# EasyEDA schematic ESP32-MoonLolita-PCB.json
TITLE: ESP32-MoonLolita; REV: 1.0; Date: 2022-09-04; Sheet: 1/1; Company: Bilibili 没人要的野指针
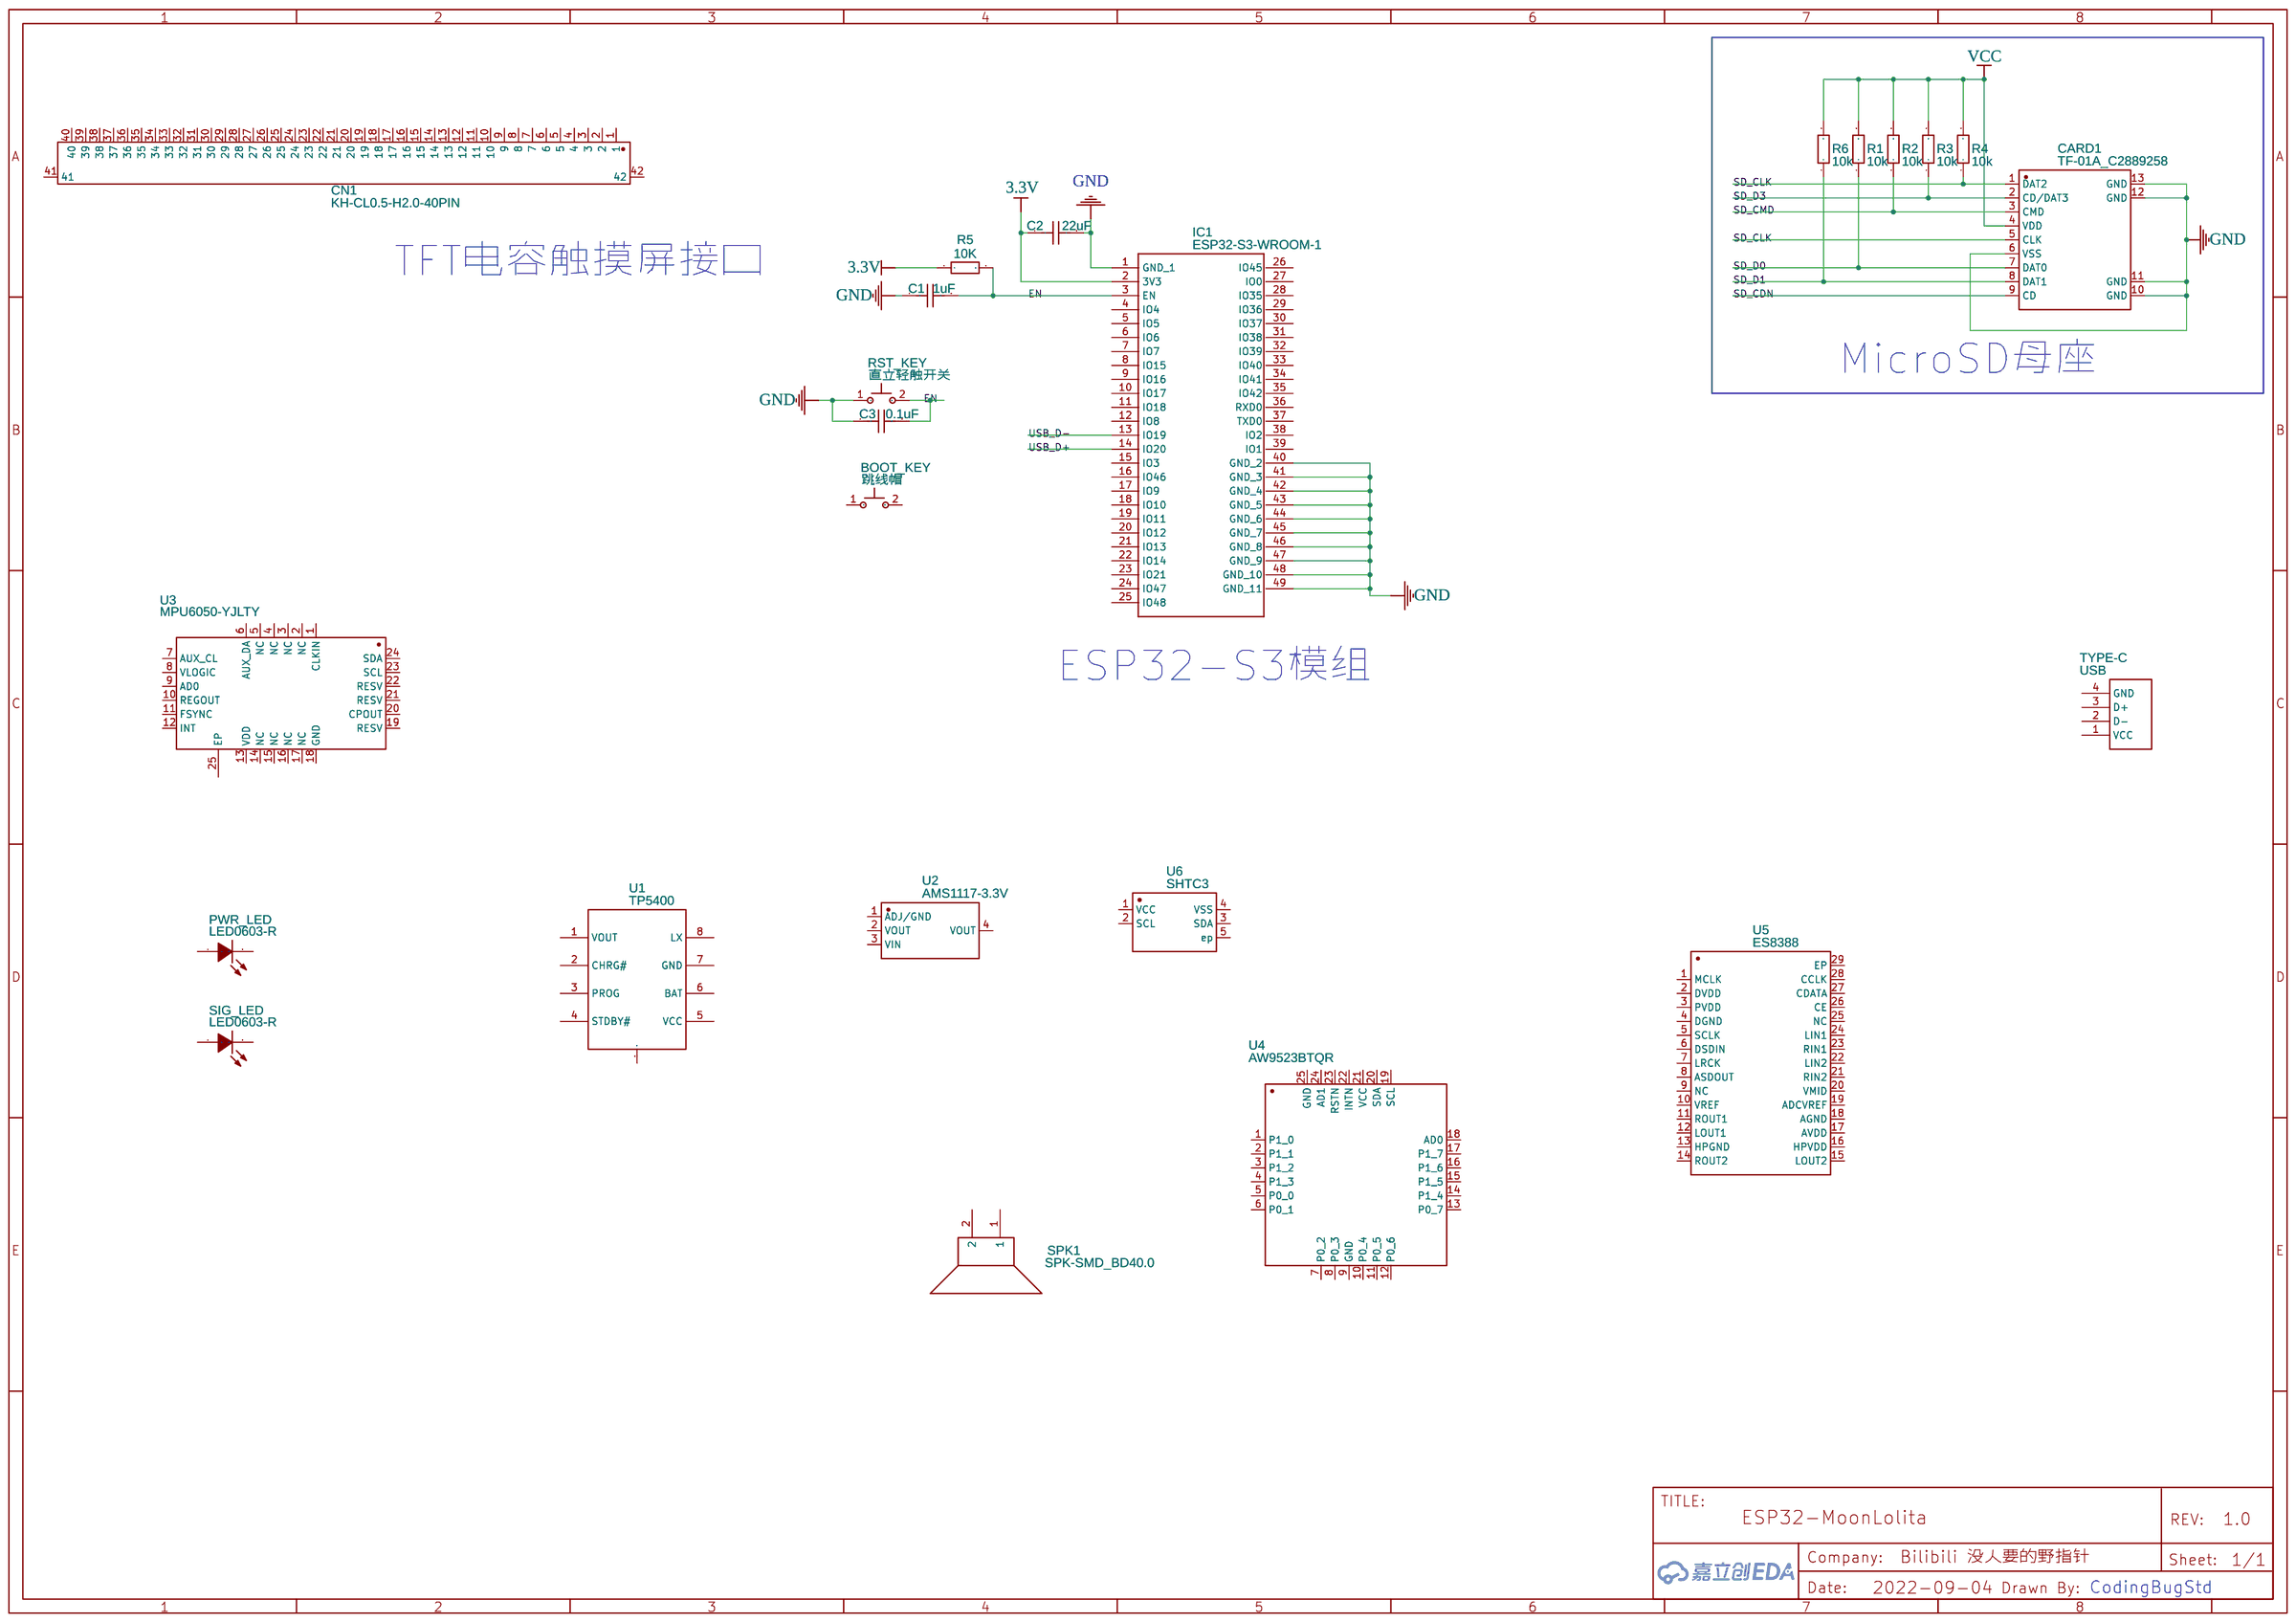
[diagram p0: schematic sheet]

## Parts
BOOT_KEY  跳线帽  [KEY-SMD_KSS-2G]
C1  1uF  [CAP-TH_L18.5-W11.5-P15.50-D1.2]
C2  22uF  [CAP-TH_L18.5-W11.5-P15.50-D1.2]
C3  0.1uF  [CAP-TH_L18.5-W11.5-P15.50-D1.2]
CARD1  TF-01A_C2889258  [TF-SMD_TF-02]
CN1  KH-CL0.5-H2.0-40PIN  [FPC-SMD_KH-CL0.5-H2.0-40PIN]
IC1  ESP32-S3-WROOM-1  [ESP32S3WROOM1]
PWR_LED  LED0603-R  [LED0603-R-RD]
R1  10k  [0603封装]
R2  10k  [0603封装]
R3  10k  [0603封装]
R4  10k  [0603封装]
R5  10K  [R1206]
R6  10k  [0603封装]
RST_KEY  直立轻触开关  [KEY-SMD_KSS-2G]
SIG_LED  LED0603-R  [LED0603-R-RD]
SPK1  SPK-SMD_BD40.0  [SPK-SMD_BD40.0]
TYPE-C  USB  [USB  USB-A-TH_USB-302-T]
U1  TP5400  [SOIC-8_L5.0-W4.0-P1.27-LS6.0-BL-EP2.0]
U2  AMS1117-3.3V  [SOT-223-4_L6.5-W3.5-P2.30-LS7.0-BR]
U3  MPU6050-YJLTY  [QFN-24_L4.0-W4.0-P0.50-BL-EP2.7]
U4  AW9523BTQR  [TQFN-24_L4.0-W4.0-P0.50-TL-EP]
U5  ES8388  [QFN-28_L4.0-W4.0-P0.45-BL-EP]
U6  SHTC3  [SENSORM-SMD_4P-L2.0-W2.0-P1.00]

## Library data of the parts
BOOT_KEY RST_KEY = KSS341GLFS: Supplier: LCSC; Supplier Part: C221798; Manufacturer: C&K; Contributor: LCSC; JLCPCB Part Class: Extended Part
C1-C3 = FGSM(161) 630VDC 224J 101F: Supplier: LCSC; Supplier Part: C185991; Manufacturer: SHINYEI; Contributor: LCSC; JLCPCB Part Class: Extended Part
CARD1 = TF-01A_C2889258: Supplier: LCSC; Supplier Part: C2889258; Manufacturer: Yuandi(台湾元迪); Manufacturer Part: TF-01A; Contributor: LCSC; JLCPCB Part Class: Extended Part
CN1 = KH-CL0.5-H2.0-40PIN: Supplier: LCSC; Supplier Part: C2797203; Manufacturer: kinghelm(金航标); JLCPCB Part Class: Extended Part; Contributor: LCSC
IC1 = ESP32-S3-WROOM-1: Contributor: D6_204
PWR_LED SIG_LED = LED0603-R: Supplier: LCSC; Supplier Part: C9900005326; JLCPCB Part Class: Extended Part; Contributor: LCSC
R1-R4 R6 = 电阻0603: Supplier: HeZo; Manufacturer Part: 电阻0805; Manufacturer: HeZo; Supplier Part: 电阻0805; Contributor: 徐州合卓技术服务
R5 = 1206W4F1212T5E: Supplier: LCSC; Supplier Part: C247391; Manufacturer: Uniroyal Elec; Resistance (Ohms): 12.1K; Contributor: LCSC; JLCPCB Part Class: Extended Part
SPK1 = SPK-SMD_BD40.0: Contributor: shenruicn
TYPE-C = USB: Supplier: LCSC; Supplier Part: C386740; Manufacturer: Shenzhen Cankemeng; Manufacturer Part: U-USBAR04P-F000; Contributor: h1954063786
U1 = TP5400: Supplier: LCSC; Manufacturer: TOPPOWER; Supplier Part: C24154; JLCPCB Part Class: Extended Part
U2 = AMS1117-3.3V: Supplier: LCSC; Supplier Part: C2688239; Manufacturer: WPMtek(维攀微); Contributor: LCSC; JLCPCB Part Class: Extended Part
U3 = MPU6050-YJLTY: Supplier: LCSC; Supplier Part: C2912107; Manufacturer: null; JLCPCB Part Class: Extended Part; Contributor: LCSC
U4 = AW9523BTQR: Supplier: LCSC; Manufacturer: AWINIC; Contributor: LCSC; Supplier Part: C148077; JLCPCB Part Class: Extended Part
U5 = ES8388: Supplier: LCSC; Supplier Part: C365736; Manufacturer: Everest Semiconductor; Contributor: LCSC; JLCPCB Part Class: Extended Part
U6 = SHTC3: Supplier: LCSC; Supplier Part: C194656; Manufacturer: Sensirion; Contributor: LCSC; JLCPCB Part Class: Extended Part

## Nets
3.3V: C2.1 IC1.2(3V3) R5.1
GND: C1.1 C2.2 C3.1 CARD1.6(VSS) CARD1.10(GND) CARD1.11(GND) CARD1.12(GND) CARD1.13(GND) IC1.1(GND) IC1.40(GND_2) IC1.41(GND_3) IC1.42(GND_4) IC1.43(GND_5) IC1.44(GND_6) IC1.45(GND_7) IC1.46(GND_8) IC1.47(GND_9) IC1.48(GND_10) IC1.49(GND_11) RST_KEY.1
VCC: CARD1.4(VDD) R1.2 R2.2 R3.2 R4.2 R6.2
EN: C1.2 C3.2 IC1.3(EN) R5.2 RST_KEY.2
SD_CDN: CARD1.9(CD)
SD_CLK: CARD1.1(DAT2) CARD1.5(CLK) R4.1
SD_CMD: CARD1.3(CMD) R2.1
SD_D0: CARD1.7(DAT0) R1.1
SD_D1: CARD1.8(DAT1) R6.1
SD_D3: CARD1.2(CD/DAT3) R3.1
USB_D+: IC1.14(IO20)
USB_D-: IC1.13(IO19)

Not connected (* = marked no-connect by the designer): BOOT_KEY 1 2; CN1 1 2 3 4 5 6 7 8 9 10 11 12 13 14 15 16 17 18 19 20 21 22 23 24 25 26 27 28 29 30 31 32 33 34 35 36 37 38 39 40 41 42; IC1 4(IO4) 5(IO5) 6(IO6) 7(IO7) 8(IO15) 9(IO16) 10(IO17) 11(IO18) 12(IO8) 15(IO3) 16(IO46) 17(IO9) 18(IO10) 19(IO11) 20(IO12) 21(IO13) 22(IO14) 23(IO21) 24(IO47) 25(IO48) 26(IO45) 27(IO0) 28(IO35) 29(IO36) 30(IO37) 31(IO38) 32(IO39) 33(IO40) 34(IO41) 35(IO42) 36(RXD0) 37(TXD0) 38(IO2) 39(IO1); PWR_LED 1(A) 2(K); SIG_LED 1(A) 2(K); SPK1 1 2; TYPE-C 1(VCC) 2(D-) 3(D+) 4(GND); U1 1(VOUT) 2(CHRG#) 3(PROG) 4(STDBY#) 5(VCC) 6(BAT) 7(GND) 8(LX) 9; U2 1(ADJ/GND) 2(VOUT) 3(VIN) 4(VOUT); U3 1(CLKIN) 2(NC) 3(NC) 4(NC) 5(NC) 6(AUX_DA) 7(AUX_CL) 8(VLOGIC) 9(AD0) 10(REGOUT) 11(FSYNC) 12(INT) 13(VDD) 14(NC) 15(NC) 16(NC) 17(NC) 18(GND) 19(RESV) 20(CPOUT) 21(RESV) 22(RESV) 23(SCL) 24(SDA) 25(EP); U4 1(P1_0) 2(P1_1) 3(P1_2) 4(P1_3) 5(P0_0) 6(P0_1) 7(P0_2) 8(P0_3) 9(GND) 10(P0_4) 11(P0_5) 12(P0_6) 13(P0_7) 14(P1_4) 15(P1_5) 16(P1_6) 17(P1_7) 18(AD0) 19(SCL) 20(SDA) 21(VCC) 22(INTN) 23(RSTN) 24(AD1) 25(GND); U5 1(MCLK) 2(DVDD) 3(PVDD) 4(DGND) 5(SCLK) 6(DSDIN) 7(LRCK) 8(ASDOUT) 9(NC) 10(VREF) 11(ROUT1) 12(LOUT1) 13(HPGND) 14(ROUT2) 15(LOUT2) 16(HPVDD) 17(AVDD) 18(AGND) 19(ADCVREF) 20(VMID) 21(RIN2) 22(LIN2) 23(RIN1) 24(LIN1) 25(NC) 26(CE) 27(CDATA) 28(CCLK) 29(EP); U6 1(VCC) 2(SCL) 3(SDA) 4(VSS) 5(ep)

## Notes on the sheet
- TFT电容触摸屏接口
- MicroSD母座
- ESP32-S3模组
- CodingBugStd
